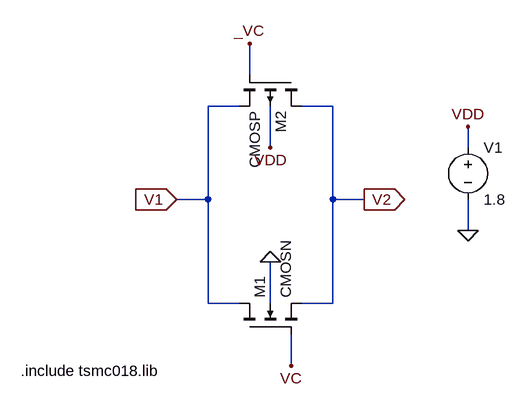
[diagram p0: schematic transmission_gate.asc]
transmission_gate.asc, the LTspice schematic file:
Version 4
SHEET 1 932 680
WIRE 240 -128 240 -176
WIRE 224 -80 176 -80
WIRE 368 -80 320 -80
WIRE 272 -16 272 -80
WIRE 576 -16 576 -48
WIRE 176 64 176 -80
WIRE 176 64 128 64
WIRE 368 64 368 -80
WIRE 416 64 368 64
WIRE 576 112 576 64
WIRE 176 224 176 64
WIRE 224 224 176 224
WIRE 272 224 272 160
WIRE 368 224 368 64
WIRE 368 224 320 224
WIRE 304 320 304 272
FLAG 272 -16 VDD
FLAG 240 -176 _VC
FLAG 304 320 VC
FLAG 128 64 V1
IOPIN 128 64 In
FLAG 416 64 V2
IOPIN 416 64 Out
FLAG 272 160 0
FLAG 576 112 0
FLAG 576 -48 VDD
SYMBOL nmos4 224 272 R270
SYMATTR InstName M1
SYMATTR Value CMOSN
SYMATTR Value2 l=0.18u w=1u
SYMBOL pmos4 320 -128 R90
SYMATTR InstName M2
SYMATTR Value CMOSP
SYMATTR Value2 l=0.18u w=2u
SYMBOL voltage 576 -32 R0
WINDOW 123 0 0 Left 0
WINDOW 39 0 0 Left 0
SYMATTR InstName V1
SYMATTR Value 1.8
TEXT -112 328 Left 2 !.include tsmc018.lib

The netlist it stands for:
* transmission_gate.asc
M1 V1 VC V2 0 CMOSN l=0.18u w=1u
M2 V2 _VC V1 VDD CMOSP l=0.18u w=2u
V1 VDD 0 1.8
.model NMOS NMOS
.model PMOS PMOS
.lib standard.mos
.include tsmc018.lib
.backanno
.end